# EAGLE design attiny-quickstart (EAGLE 7.2.0)
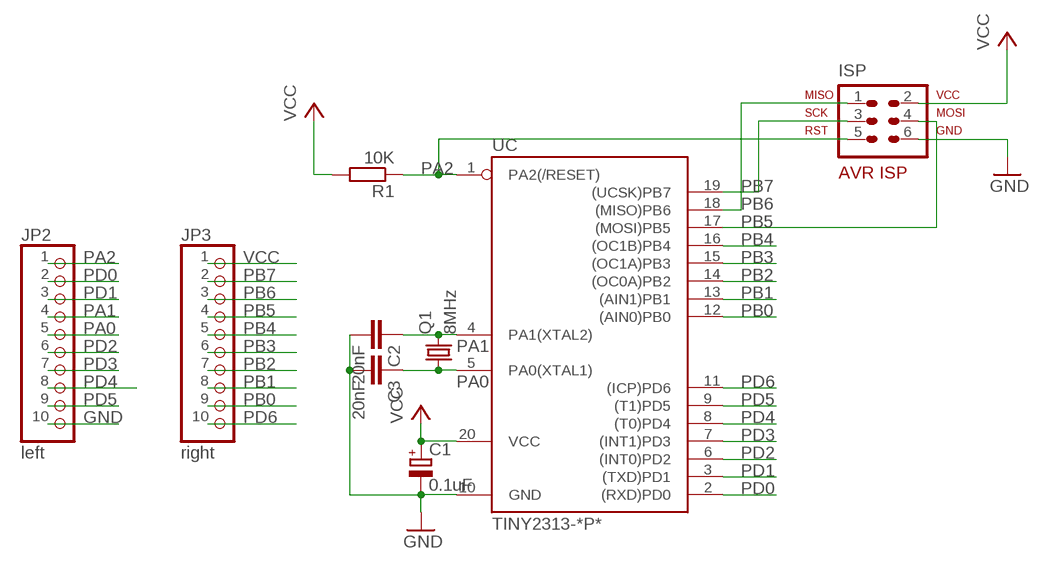
[diagram p0: schematic, sheet 1]

## Parts
C1  0.1uF  CPOL-EUE2,5-6E  [E2,5-6E]
C2  20nF  C-EU025-024X044  [C025-024X044]
C3  20nF  C-EU025-024X044  [C025-024X044]
ISP  AVR-ISP-6VERT  [AVR-ISP-6]
JP2  left  PINHD-1X10  [1X10]
JP3  right  PINHD-1X10  [1X10]
Q1  8MHz  CRYSTALHC49S  [HC49/S]
R1  10K  R-EU_0204/5  [0204/5]
UC  TINY2313-*P*  [DIL20]

## Nets
GND: C1.- C2.2 C3.2 ISP.6 JP2.10 UC.10(GND)
PA0: C3.1 JP2.5 Q1.1 UC.5(PA0(XTAL1))
PA1: C2.1 JP2.4 Q1.2 UC.4(PA1(XTAL2))
PA2: ISP.5 JP2.1 R1.1 UC.1(PA2(/RESET))
PB0: JP3.9 UC.12((AIN0)PB0)
PB1: JP3.8 UC.13((AIN1)PB1)
PB2: JP3.7 UC.14((OC0A)PB2)
PB3: JP3.6 UC.15((OC1A)PB3)
PB4: JP3.5 UC.16((OC1B)PB4)
PB5: ISP.4 JP3.4 UC.17((MOSI)PB5)
PB6: ISP.1 JP3.3 UC.18((MISO)PB6)
PB7: ISP.3 JP3.2 UC.19((UCSK)PB7)
PD0: JP2.2 UC.2((RXD)PD0)
PD1: JP2.3 UC.3((TXD)PD1)
PD2: JP2.6 UC.6((INT0)PD2)
PD3: JP2.7 UC.7((INT1)PD3)
PD4: JP2.8 UC.8((T0)PD4)
PD5: JP2.9 UC.9((T1)PD5)
PD6: JP3.10 UC.11((ICP)PD6)
VCC: C1.+ ISP.2 JP3.1 R1.2 UC.20(VCC)

## Library data of the parts
C1 = resistor:CPOL-EU: POLARIZED CAPACITOR, European symbol
C2 C3 = resistor:C-EU: CAPACITOR, European symbol
ISP = avr-7:AVR-ISP-6: AVR ISP-6 Serial Programming Header
JP2 JP3 = pinhead:PINHD-1X10: PIN HEADER
Q1 = crystal:CRYSTAL: CRYSTAL; OC_FARNELL: 1667008; OC_NEWARK: unknown
R1 = resistor:R-EU_: RESISTOR, European symbol
UC = avr-7:TINY2313*: Atmel Tiny2313 2K Flash, 128 bytes EEPROM, 128 bytes RAM

## Board
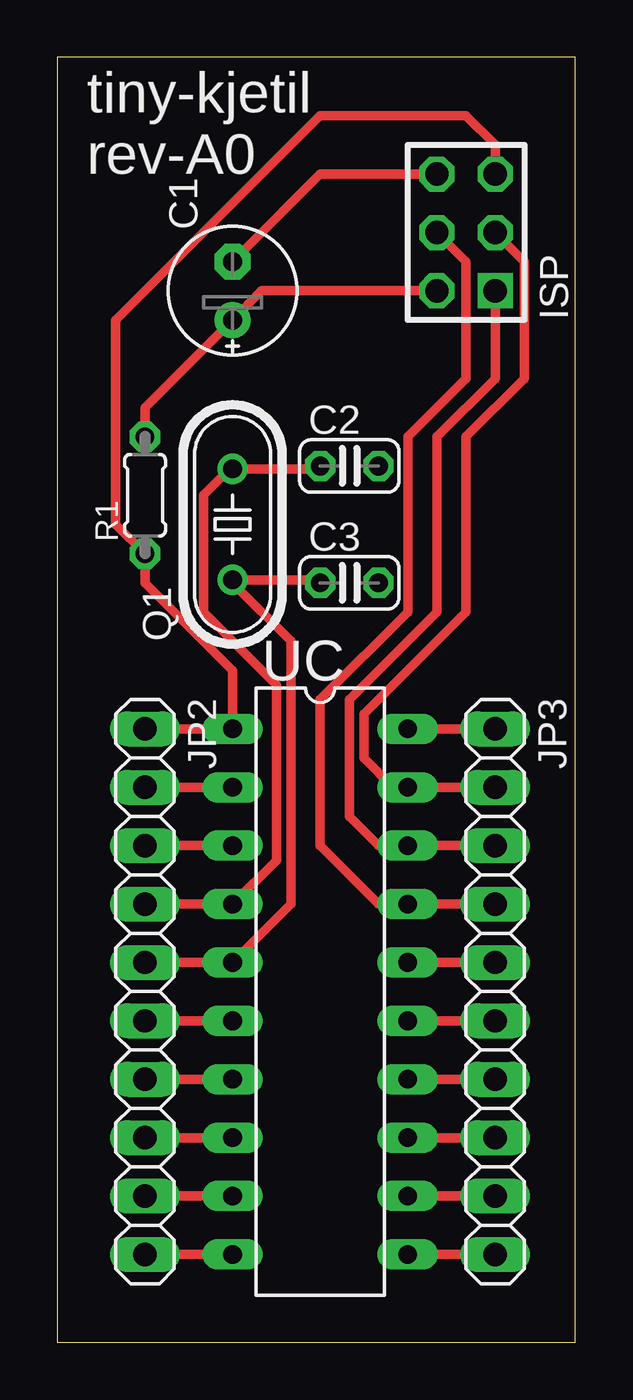
[diagram p1: board, top side]
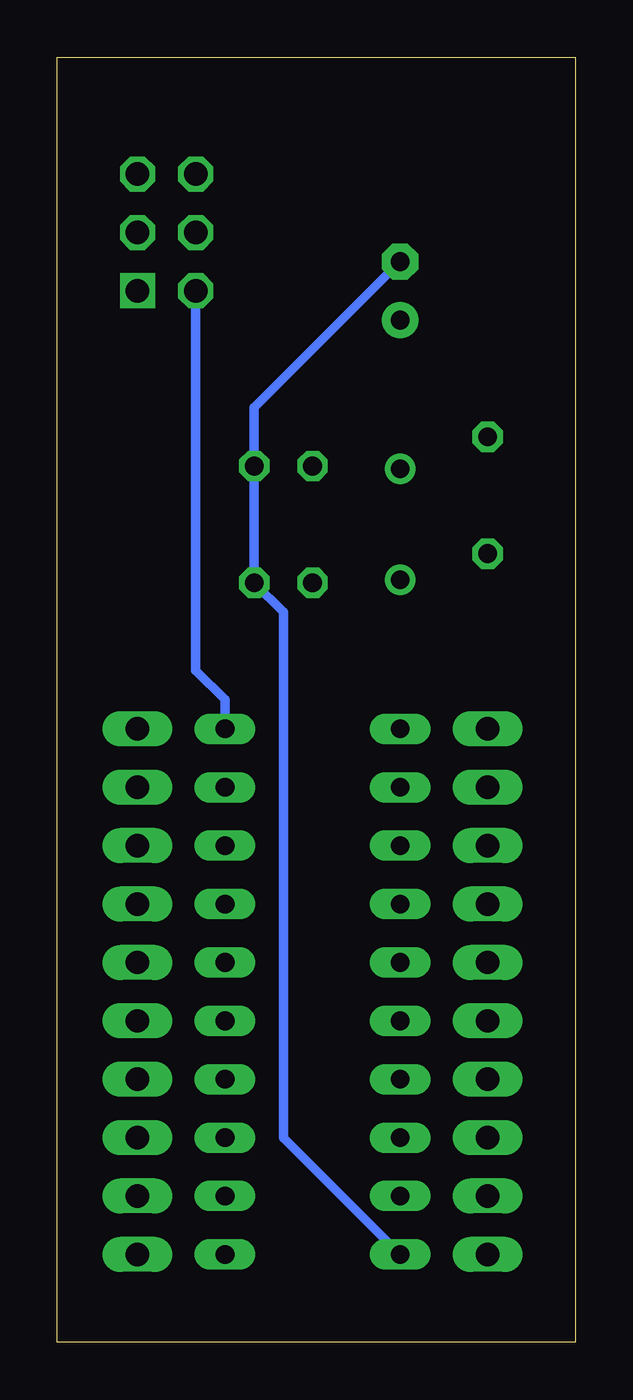
[diagram p2: board, bottom side, seen from below]

Size 22.53 x 55.87 mm. Coordinates in mm from the lower left corner, seen from the top.
Outline: 0,0 22.53,0 22.53,55.87 0,55.87 0,0
Copper layers (1*16): Top 0.035mm / dielectric 1.5mm / Bottom 0.035mm
Design rules "default": minimum track width 10mil, minimum drill 24mil, track to track 8mil, track to pad 8mil, pad to pad 8mil, via to via 8mil, smd to smd 8mil, copper to edge 40mil, drill to drill 8mil, minimum pad ring 10mil, minimum via ring 8mil, stop-mask expansion 4mil, vias tented up to drill 0mil, thermal gap 10mil

### Footprints (pad centres in the part's own frame; a part is rotated, then mirrored left to right if it is on the bottom)
E2,5-6E = drill 0.813 pad 1.575: + -1.27,0 | drill 0.813 pad 1.575 octagon: - 1.27,0
C025-024X044 = drill 0.813 octagon: 1 -1.27,0; 2 1.27,0
AVR-ISP-6 = drill 1.016 square: 1 -2.54,-1.27 | drill 1.016 octagon: 2 -2.54,1.27; 3 0,-1.27; 4 0,1.27; 5 2.54,-1.27; 6 2.54,1.27
1X10 = drill 1.016 long: 1 -11.43,0; 2 -8.89,0; 3 -6.35,0; 4 -3.81,0; 5 -1.27,0; 6 1.27,0; 7 3.81,0; 8 6.35,0; 9 8.89,0; 10 11.43,0
HC49/S = drill 0.813: 1 -2.413,0; 2 2.413,0
0204/5 = drill 0.813 octagon: 1 -2.54,0; 2 2.54,0
DIL20 = drill 0.813 long: 1 -11.43,-3.81; 2 -8.89,-3.81; 3 -6.35,-3.81; 4 -3.81,-3.81; 5 -1.27,-3.81; 6 1.27,-3.81; 7 3.81,-3.81; 8 6.35,-3.81; 9 8.89,-3.81; 10 11.43,-3.81; 11 11.43,3.81; 12 8.89,3.81; 13 6.35,3.81; 14 3.81,3.81; 15 1.27,3.81; 16 -1.27,3.81; 17 -3.81,3.81; 18 -6.35,3.81; 19 -8.89,3.81; 20 -11.43,3.81

### Placement (x,y rotation side)
C1  7.62,45.72 90 top
C2  12.7,38.1 0 top
C3  12.7,33.02 0 top
ISP  17.78,48.26 90 top
JP2  3.81,15.24 270 top
JP3  19.05,15.24 270 top
Q1  7.62,35.56 90 top
R1  3.81,36.83 90 top
UC  11.43,15.24 270 top

### Tracks (layer width: path | path; a pad name or v marks a point on that pad's centre or on a via)
GND
  Top 0.406: JP2.10 UC.10 | C1.- 11.43,50.8 ISP.6
  Bottom 0.406: UC.10 12.7,8.89 12.7,31.75 C3.2 C2.2 13.97,40.64 C1.-
PA0
  Top 0.406: JP2.5 UC.5 10.16,19.05 10.16,30.48 7.62,33.02 Q1.1 11.43,33.15 C3.1
PA1
  Top 0.406: JP2.4 UC.4 9.53,20.95 9.53,28.57 6.35,31.75 6.35,36.83 7.49,37.97 Q1.2 11.43,37.97 C2.1
PA2
  Top 0.406: JP2.1 UC.1 7.62,29.21 3.81,33.02 R1.1 2.54,35.56 2.54,44.45 11.43,53.34 17.78,53.34 19.05,52.07 ISP.5
PB0
  Top 0.406: JP3.9 UC.12
PB1
  Top 0.406: JP3.8 UC.13
PB2
  Top 0.406: JP3.7 UC.14
PB3
  Top 0.406: JP3.6 UC.15
PB4
  Top 0.406: JP3.5 UC.16
PB5
  Top 0.406: JP3.4 UC.17 13.97,19.05 11.43,21.59 11.43,27.94 15.24,31.75 15.24,39.37 17.78,41.91 17.78,46.99 ISP.4
PB6
  Top 0.406: JP3.3 UC.18 13.97,21.59 12.7,22.86 12.7,27.94 16.51,31.75 16.51,39.37 19.05,41.91 ISP.1
PB7
  Top 0.406: JP3.2 UC.19 14.61,24.13 13.33,25.4 13.33,27.3 17.78,31.75 17.78,39.37 20.32,41.91 20.32,46.99 ISP.3
PD0
  Top 0.406: JP2.2 UC.2
PD1
  Top 0.406: JP2.3 UC.3
PD2
  Top 0.406: JP2.6 UC.6
PD3
  Top 0.406: JP2.7 UC.7
PD4
  Top 0.406: JP2.8 UC.8
PD5
  Top 0.406: JP2.9 UC.9
PD6
  Top 0.406: JP3.10 UC.11
VCC
  Top 0.406: JP3.1 UC.20 | R1.2 3.81,40.64 C1.+ 8.89,45.72 ISP.2
  Bottom 0.406: UC.20 15.24,27.94 16.51,29.21 ISP.2

### Text on the board
tPlace: tiny-kjetil / rev-A0